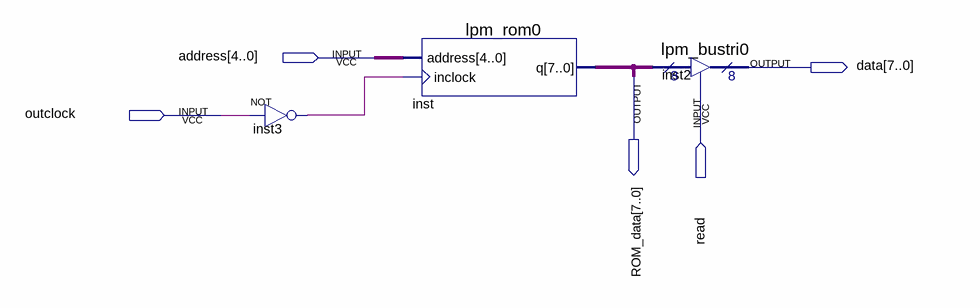
[diagram p0: schematic sheet]
// Quartus schematic ROM.bdf as structural Verilog: 3 symbols, 5 pins
module ROM (
  input  [4:0] address,
  input  read,
  input  outclock,
  output [7:0] data,
  output [7:0] ROM_data
);

  wire inst3_out;

  not inst3 (inst3_out, outclock);
  lpm_rom0 inst (.address(address), .inclock(inst3_out), .q(ROM_data));
  lpm_bustri0 inst2 (.enabledt(read), .data(ROM_data), .tridata(data));
endmodule
